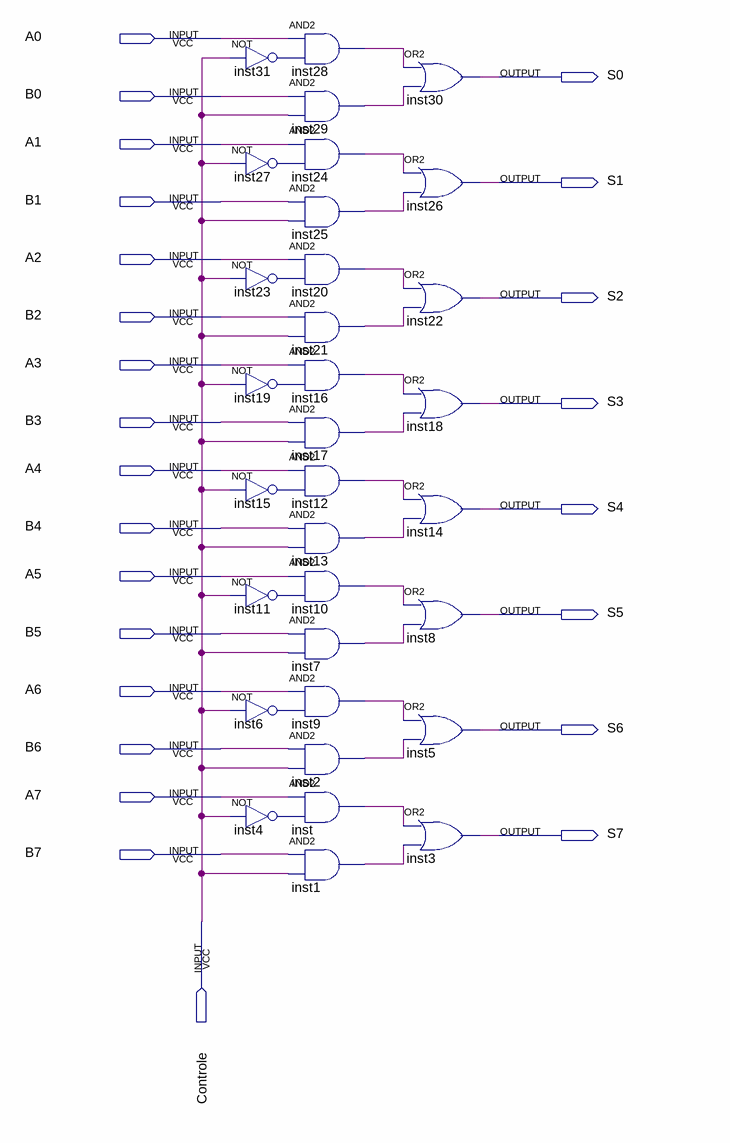
[diagram p0: schematic sheet]
// Quartus schematic Mux16X8.bdf as structural Verilog: 32 symbols, 25 pins
module Mux16X8 (
  input  A0,
  input  B0,
  input  A1,
  input  B1,
  input  A2,
  input  B2,
  input  A3,
  input  B3,
  input  A4,
  input  B4,
  input  A5,
  input  B5,
  input  A6,
  input  B6,
  input  A7,
  input  B7,
  input  Controle,
  output S0,
  output S1,
  output S2,
  output S3,
  output S4,
  output S5,
  output S6,
  output S7
);

  wire inst1_out, inst2_out, inst4_out, inst6_out, inst7_out, inst9_out, inst10_out, inst11_out, inst12_out,
       inst13_out, inst15_out, inst16_out, inst17_out, inst19_out, inst20_out, inst21_out, inst23_out,
       inst24_out, inst25_out, inst27_out, inst28_out, inst29_out, inst31_out, inst_out;

  not inst31 (inst31_out, Controle);
  not inst27 (inst27_out, Controle);
  not inst23 (inst23_out, Controle);
  not inst19 (inst19_out, Controle);
  not inst15 (inst15_out, Controle);
  not inst11 (inst11_out, Controle);
  not inst6 (inst6_out, Controle);
  not inst4 (inst4_out, Controle);
  and inst28 (inst28_out, A0, inst31_out);
  and inst29 (inst29_out, B0, Controle);
  and inst24 (inst24_out, A1, inst27_out);
  and inst25 (inst25_out, B1, Controle);
  and inst20 (inst20_out, A2, inst23_out);
  and inst21 (inst21_out, B2, Controle);
  and inst16 (inst16_out, A3, inst19_out);
  and inst17 (inst17_out, B3, Controle);
  and inst12 (inst12_out, A4, inst15_out);
  and inst13 (inst13_out, B4, Controle);
  and inst10 (inst10_out, A5, inst11_out);
  and inst7 (inst7_out, B5, Controle);
  and inst9 (inst9_out, A6, inst6_out);
  and inst2 (inst2_out, B6, Controle);
  and inst (inst_out, A7, inst4_out);
  and inst1 (inst1_out, B7, Controle);
  or inst30 (S0, inst28_out, inst29_out);
  or inst26 (S1, inst24_out, inst25_out);
  or inst22 (S2, inst20_out, inst21_out);
  or inst18 (S3, inst16_out, inst17_out);
  or inst14 (S4, inst12_out, inst13_out);
  or inst8 (S5, inst10_out, inst7_out);
  or inst5 (S6, inst9_out, inst2_out);
  or inst3 (S7, inst_out, inst1_out);
endmodule
